# EAGLE design Rauchmelder 3.8.3 (EAGLE 9.6.2)
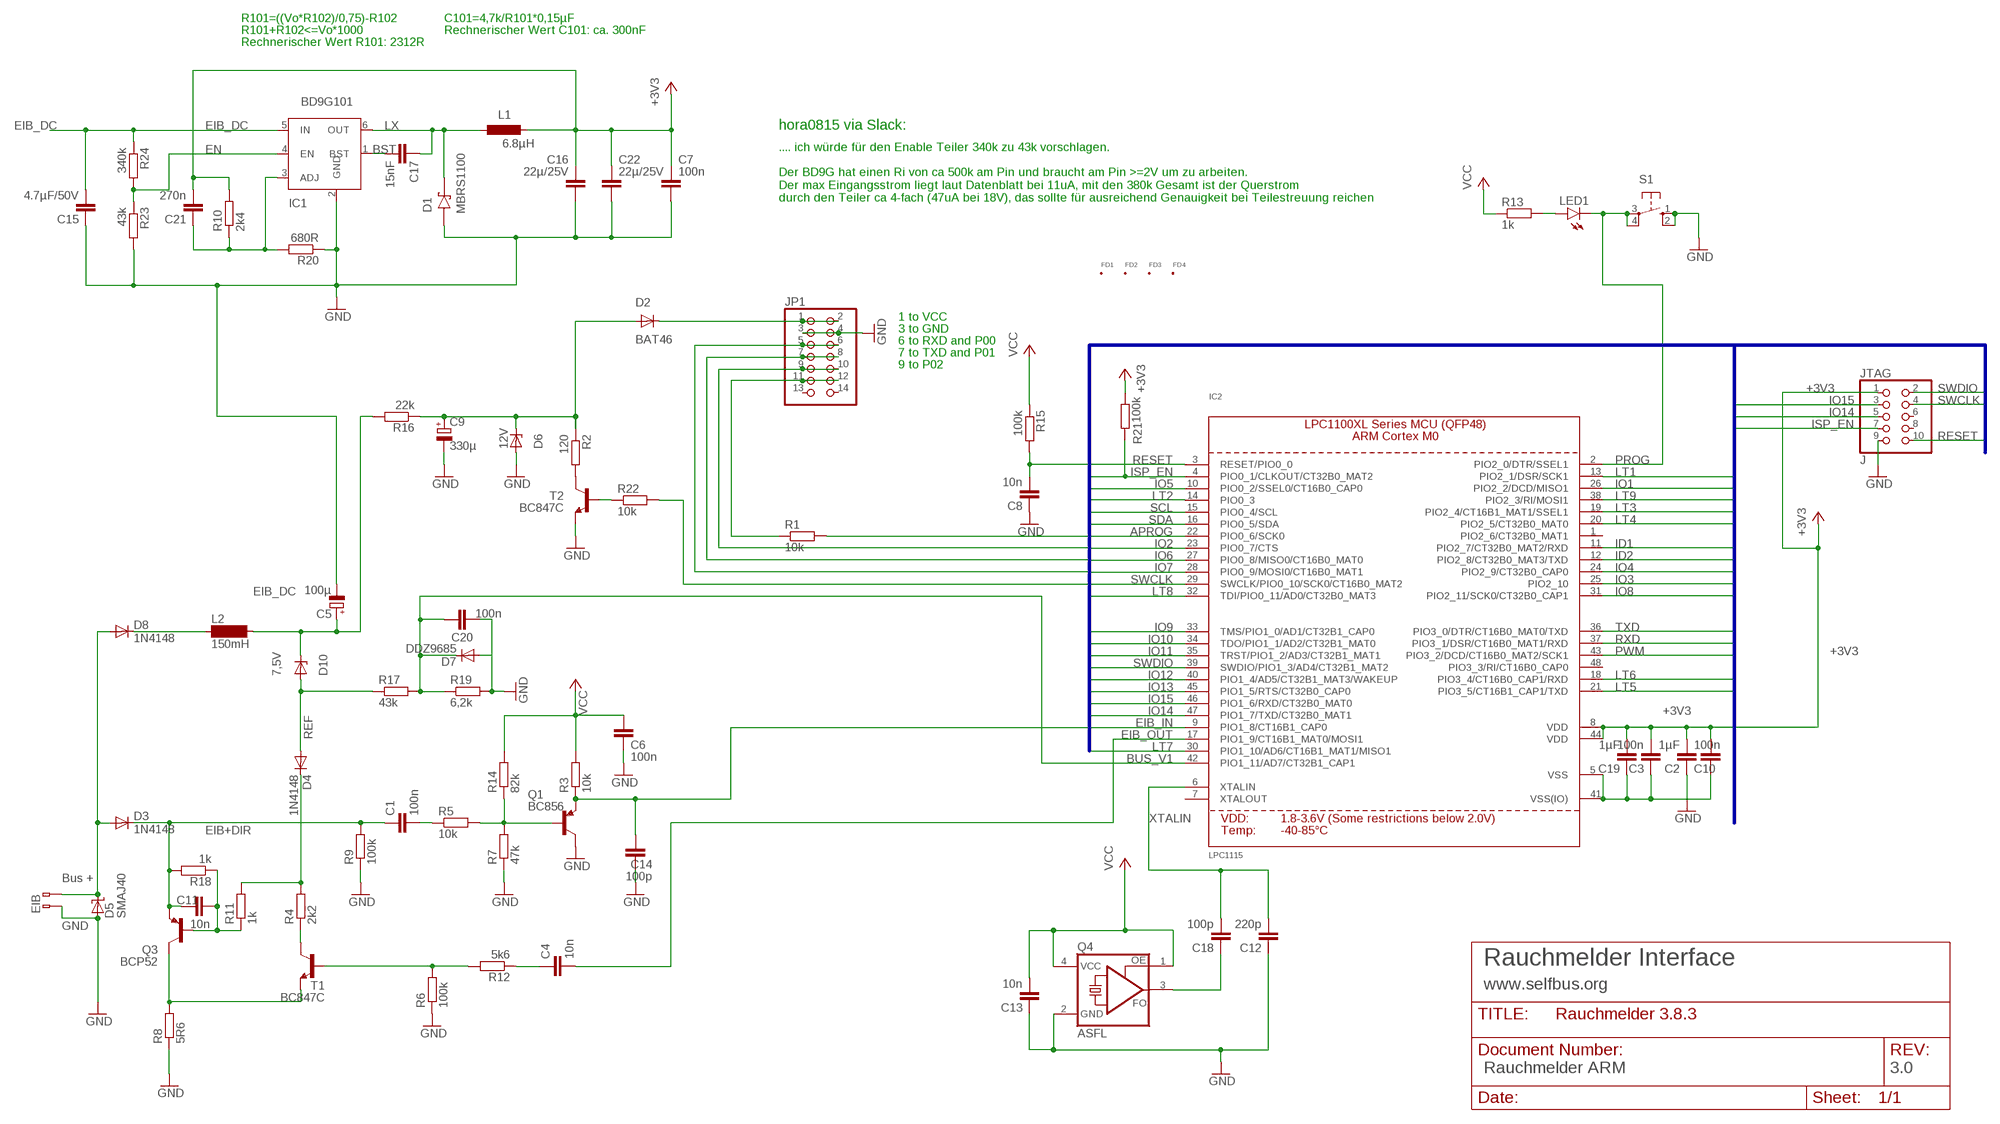
[diagram p0: schematic, sheet 1]

## Parts
C1  100n  C-EUC1206  [C1206]
C2  1µF  C-EUC1206  [C1206]
C3  100n  C-EUC1206  [C1206]
C4  10n  C-EUC1206  [C1206]
C5  100µ  CPOL-EUSANYO_SMD_C6  [SANYO-OSCON_SMD_C6]
C6  100n  C-EUC1206  [C1206]
C7  100n  C-EUC1206  [C1206]
C8  10n  C-EUC1206  [C1206]
C9  330µ  CPOL-EUE3.5-8  [E3,5-8]
C10  100n  C-EUC1206  [C1206]
C11  10n  C-EUC1206  [C1206]
C12  220p  C-EUC1206  [C1206]
C13  10n  C-EUC1206  [C1206]
C14  100p  C-EUC1206  [C1206]
C15  4.7µF/50V  C-EUC1206  [C1206]
C16  22µ/25V  C-EUC1206  [C1206]
C17  15nF  C-EUC1206  [C1206]
C18  100p  C-EUC1206  [C1206]
C19  1µF  C-EUC1206  [C1206]
C20  100n  C-EUC1206  [C1206]
C21  270n  C-EUC1206  [C1206]
C22  22µ/25V  C-EUC1206  [C1206]
D1  MBRS1100  SCHOTTKY-DIODE-MBR130LSFT1  [SOD123FL]
D2  BAT46  DIODE-MINIMELF  [MINIMELF]
D3  1N4148  DIODE-MINIMELF  [MINIMELF]
D4  1N4148  DIODE-MINIMELF  [MINIMELF]
D5  SMAJ40  SUPPRESSOR-SMBJ  [SMBJ]
D6  12V  ZPD  [MINIMELF]
D7  DDZ9685  DIODE-MINIMELF  [MINIMELF]
D8  1N4148  DIODE-MINIMELF  [MINIMELF]
D10  7,5V  ZPD  [MINIMELF]
FD1  FID_40MIL  [FID_040]
FD2  FID_40MIL  [FID_040]
FD3  FID_40MIL  [FID_040]
FD4  FID_40MIL  [FID_040]
IC1  BD9G101  BD9G101GBD9G101G-SOT23-6  [SOT23-6]
IC2  LPC1115  LPC1113/4/5_QFP48_XLSERIES  [LQFP48]
JP1  PINHD-2X7  [2X07]
JTAG  J  PINHD-2X05_2.00  [2X05M]
L1  6.8µH  L-EUL4532P  [L4532P]
L2  150mH  BS11  [BS11]
LED1  LEDCHIPLED_1206  [CHIPLED_1206]
Q1  BC856  BC856ALT1SMD  [SOT23-BEC]
Q3  BCP52  FZT753SMD  [SOT223]
Q4  ASFL  [ASF]
R1  10k  R-EU_R1206  [R1206]
R2  120  R-EU_R1206  [R1206]
R3  10k  R-EU_R1206  [R1206]
R4  2k2  R-EU_R1206  [R1206]
R5  10k  R-EU_R1206  [R1206]
R6  100k  R-EU_R1206  [R1206]
R7  47k  R-EU_R1206  [R1206]
R8  5R6  R-EU_R1210  [R1210]
R9  100k  R-EU_R1206  [R1206]
R10  2k4  R-EU_R1206  [R1206]
R11  1k  R-EU_R1206  [R1206]
R12  5k6  R-EU_R1206  [R1206]
R13  1k  R-EU_R1206  [R1206]
R14  82k  R-EU_R1206  [R1206]
R15  100k  R-EU_R1206  [R1206]
R16  22k  R-EU_R1206  [R1206]
R17  43k  R-EU_R1206  [R1206]
R18  1k  R-EU_R1206  [R1206]
R19  6,2k  R-EU_R1206  [R1206]
R20  680R  R-EU_R1206  [R1206]
R21  100k  R-EU_R1206  [R1206]
R22  10k  R-EU_R1206  [R1206]
R23  43k  R-EU_R1206  [R1206]
R24  340k  R-EU_R1206  [R1206]
S1  10-XX  [B3F-10XX]
T1  BC847C  [SOT23]
T2  BC847C  [SOT23]
U$1  EIB  [BUSKLEMME243-724]

## Nets
+3V3: C2.2 C3.2 C6.2 C7.1 C10.2 C13.2 C16.1 C19.2 C21.2 C22.1 IC2.8(VDD) IC2.44(VDD) JTAG.1 L1.2 Q4.1(OE) Q4.4(VCC) R3.2 R10.2 R13.1 R14.2 R15.1 R21.2 ; supply symbol labelled VCC
APROG: IC2.22(PIO0_6/SCK0)
BST: C17.2 IC1.1(BST)
BUS_V1: C20.2 D7.C IC2.42(PIO1_11/AD7/CT32B1_CAP1) R17.2 R19.1
EIB+: D3.A D5.C D8.A U$1.2(B-2)
EIB+DIR: C1.1 C11.1 D3.C Q3.3(E) R9.2 R18.2
EIB_DC: C5.+ C15.2 D10.C IC1.5(IN) L2.2 R16.2 R24.1
EIB_IN: C14.2 IC2.9(PIO1_8/CT16B1_CAP0) Q1.E R3.1
EIB_OUT: C4.2 IC2.17(PIO1_9/CT16B1_MAT0/MOSI1)
EN: IC1.4(EN) R23.1 R24.2
FB1: C21.1 IC1.3(ADJ) R10.1 R20.2
GND: C2.1 C3.1 C5.- C6.1 C7.2 C8.1 C9.- C10.1 C12.1 C13.1 C14.1 C15.1 C16.2 C19.1 C20.1 C22.2 D1.A D5.A D6.A D7.A IC1.2(GND) IC2.5(VSS) IC2.41(VSS(IO)) JP1.3 JP1.4 JTAG.9 Q1.C Q4.2(GND) R6.1 R7.1 R8.1 R9.1 R19.2 R20.1 R23.2 S1.1(S) S1.2(S1) T2.2(E) U$1.1(B-1)
ID1: IC2.11(PIO2_7/CT32B0_MAT2/RXD)
ID2: IC2.12(PIO2_8/CT32B0_MAT3/TXD)
IO1: IC2.26(PIO2_2/DCD/MISO1)
IO2: IC2.23(PIO0_7/CTS)
IO3: IC2.25(PIO2_10)
IO4: IC2.24(PIO2_9/CT32B0_CAP0)
IO5: IC2.10(PIO0_2/SSEL0/CT16B0_CAP0)
IO6: IC2.27(PIO0_8/MISO0/CT16B0_MAT0)
IO7: IC2.28(PIO0_9/MOSI0/CT16B0_MAT1)
IO8: IC2.31(PIO2_11/SCK0/CT32B0_CAP1)
IO9: IC2.33(TMS/PIO1_0/AD1/CT32B1_CAP0)
IO10: IC2.34(TDO/PIO1_1/AD2/CT32B1_MAT0)
IO11: IC2.35(TRST/PIO1_2/AD3/CT32B1_MAT1)
IO12: IC2.40(PIO1_4/AD5/CT32B1_MAT3/WAKEUP)
IO13: IC2.45(PIO1_5/RTS/CT32B0_CAP0)
IO14: IC2.47(PIO1_7/TXD/CT32B0_MAT1) JTAG.5
IO15: IC2.46(PIO1_6/RXD/CT32B0_MAT0) JTAG.3
ISP_EN: IC2.4(PIO0_1/CLKOUT/CT32B0_MAT2) JTAG.7 R21.1
LT1: IC2.13(PIO2_1/DSR/SCK1) R22.2
LT2: IC2.14(PIO0_3)
LT3: IC2.19(PIO2_4/CT16B1_MAT1/SSEL1)
LT4: IC2.20(PIO2_5/CT32B0_MAT0)
LT5: IC2.21(PIO3_5/CT16B1_CAP1/TXD) JP1.9 JP1.10
LT6: IC2.18(PIO3_4/CT16B0_CAP1/RXD)
LT7: IC2.30(PIO1_10/AD6/CT16B1_MAT1/MISO1)
LT8: IC2.32(TDI/PIO0_11/AD0/CT32B0_MAT3) R1.2
LT9: IC2.38(PIO2_3/RI/MOSI1)
LX: C17.1 D1.C IC1.6(OUT) L1.1
N$1: JP1.11 JP1.12 R1.1
N$2: Q1.B R5.2 R7.2 R14.1
N$3: R2.2 T2.3(C)
N$4: C11.2 Q3.1(B) R11.1 R18.1
N$5: R22.1 T2.1(B)
N$9: LED1.A R13.2
N$10: C9.+ D2.A D6.C R2.1 R16.1
N$13: D8.C L2.1
N$16: C1.2 R5.1
N$18: D2.C JP1.1 JP1.2
N$22: C4.1 R12.1
N$23: R4.1 T1.3(C)
N$25: D4.C R4.2 R11.2
N$26: Q3.2(C) Q3.4(C) R8.2 T1.2(E)
N$34: R6.2 R12.2 T1.1(B)
N$35: C18.1 Q4.3(FO)
PROG: IC2.2(PIO2_0/DTR/SSEL1) LED1.C S1.3(P) S1.4(P1)
PWM: IC2.43(PIO3_2/DCD/CT16B0_MAT2/SCK1)
REF: D4.A D10.A R17.1
RESET: C8.2 IC2.3(RESET/PIO0_0) JTAG.10 R15.2
RXD: IC2.37(PIO3_1/DSR/CT16B0_MAT1/RXD) JP1.5 JP1.6
SCL: IC2.15(PIO0_4/SCL)
SDA: IC2.16(PIO0_5/SDA)
SWCLK: IC2.29(SWCLK/PIO0_10/SCK0/CT16B0_MAT2) JTAG.4
SWDIO: IC2.39(SWDIO/PIO1_3/AD4/CT32B1_MAT2) JTAG.2
TXD: IC2.36(PIO3_0/DTR/CT16B0_MAT0/TXD) JP1.7 JP1.8
XTALIN: C12.2 C18.2 IC2.6(XTALIN)
Unconnected: IC2.1(PIO2_6/CT32B0_MAT1) IC2.7(XTALOUT) IC2.48(PIO3_3/RI/CT16B0_CAP0) JP1.13 JP1.14 JTAG.6 JTAG.8

## Buses
APROG,ID1,ID2,IO[1..15],ISP_EN,LT[1..9],PWM,RESET,RXD,SCL,SDA,SWCLK,SWDIO,TXD

## Notes on the sheet
- R101=((Vo*R102)/0,75)-R102 | C101=4,7k/R101*0,15µF
- R101+R102<=Vo*1000 | Rechnerischer Wert C101: ca. 300nF
- Rechnerischer Wert R101: 2312R
- hora0815 via Slack:
- .... ich würde für den Enable Teiler 340k zu 43k vorschlagen. 
  
  Der BD9G hat einen Ri von ca 500k am Pin und braucht am Pin >=2V um zu arbeiten. 
  Der max Eingangsstrom liegt laut Datenblatt bei 11uA, mit den 380k Gesamt ist der Querstrom 
  durch den Teiler ca 4-fach (47uA bei 18V), das sollte für ausreichend Genauigkeit bei Teilestreuung reichen
- 1 to VCC
- 3 to GND
- 6 to RXD and P00
- 7 to TXD and P01
- 9 to P02
- Bus +
- GND
- Rauchmelder Interface
- www.selfbus.org
- Rauchmelder ARM | 3.0

## Library data of the parts
C1-C4 C6 C8 C10-C14 C18-C20 = rcl:C-EU: CAPACITOR, European symbol
C5 C9 = rcl:CPOL-EU: POLARIZED CAPACITOR, European symbol
C7 = rcl:C-EU: CAPACITOR, European symbol; REICHELT: X7R-G0805 100N; SPICEPREFIX: C
C15 = rcl:C-EU: CAPACITOR, European symbol; REICHELT: X7R-G1206 4,7/50; SPICEPREFIX: C
C16 C22 = rcl:C-EU: CAPACITOR, European symbol; REICHELT: X5R-G0805 22/6; SPICEPREFIX: C
C17 = rcl:C-EU: CAPACITOR, European symbol; REICHELT: X7R-G0805 15N; SPICEPREFIX: C
C21 = rcl:C-EU: CAPACITOR, European symbol; REICHELT: Y5R-G0603 220N; SPICEPREFIX: C
D1 = bt_diode:SCHOTTKY-DIODE: Schottky Diode; ALTERNATIVE#1: RB060M-60; ALTERNATIVE#2: MBRS1100; REICHELT: MBRS 1100 SMD
D2-D4 D8 = diode:DIODE-: DIODE
D5 = diode:SUPPRESSOR-: Suppressor diode
D6 D10 = diode:ZPD: Z DIODE 500 mW
D7 = diode:DIODE-: DIODE; ALTERNATIVE: MMSZ4684T1G
FD1-FD4 = Fiducial:FID: Fiducial marks. Top and Bottom copper with stop mask
IC1 = Stefan_selfbus:BD9G101G
IC2 = microbuilder:LPC1113/4/5_QFP48_XLSERIES: LPC1113/4/5 ARM Cortex M0 MCU (50MHz) - XL Series (FBD48/3x3) LPC1115FBD48/303: Max Frequency: 50MHz Flash: 64kB SRAM: 8kB ADC: 10-bit
JP1 = pinhead:PINHD-2X7: PIN HEADER
JTAG = pinhead-2:PINHD-2X05: PIN HEADER
L1 = rcl_changed:L-EU: INDUCTOR, European symbol; REICHELT: L-1616FPS 6,8µ; SPICEPREFIX: L
L2 = inductor-neosid:BS: INDUCTOR nominal inductance, magnetically screened
LED1 = led:LED: LED OSRAM: - CHIPLED LG R971, LG N971, LY N971, LG Q971, LY Q971, LO R971, LY R971 LH N974, LH R974 LS Q976, LO Q976, LY Q976 LO Q996 - Hyper CHIPLED LW Q18S LB Q993, LB Q99A, LB R99A - SideLED LS A670, LO A670, LY A670, LG A670, LP A670 LB A673, LV A673, LT A673, LW A673 LH A674 LY A675 LS A676, LA A676, LO A676, LY A676, LW A676 LS A679, LY A679, LG A679 - Hyper Micro SIDELED® LS Y876, LA Y876, LO Y876, LY Y876 LT Y87S - SmartLED LW L88C, LW L88S LB L89C, LB L89S, LG L890 LS L89K, LO L89K, LY L89K LS L896, LA L896, LO L896, LY L896 - TOPLED LS T670, LO T670, LY T670, LG T670, LP T670 LSG T670, LSP T670, LSY T670, LOP T670, LYG T670 LG T671, LOG T671, LSG T671 LB T673, LV T673, LT T673, LW T673 LH T674 LS T676, LA T676, LO T676, LY T676, LB T676, LH T676, LSB T676, LW T676 LB T67C, LV T67C, LT T67C, LS T67K, LO T67K, LY T67K, LW E67C LS E67B, LA E67B, LO E67B, LY E67B, LB E67C, LV E67C, LT E67C LW T67C LS T679, LY T679, LG T679 LS T770, LO T770, LY T770, LG T770, LP T770 LB T773, LV T773, LT T773, LW T773 LH T774 LS E675, LA E675, LY E675, LS T675 LS T776, LA T776, LO T776, LY T776, LB T776 LHGB T686 LT T68C, LB T68C - Hyper Mini TOPLED® LB M676 - Mini TOPLED Santana® LG M470 LS M47K, LO M47K, LY M47K Source: http://www.osram.convergy.de LUXEON: - LUMILED® LXK2-PW12-R00, LXK2-PW12-S00, LXK2-PW14-U00, LXK2-PW14-V00 LXK2-PM12-R00, LXK2-PM12-S00, LXK2-PM14-U00 LXK2-PE12-Q00, LXK2-PE12-R00, LXK2-PE12-S00, LXK2-PE14-T00, LXK2-PE14-U00 LXK2-PB12-K00, LXK2-PB12-L00, LXK2-PB12-M00, LXK2-PB14-N00, LXK2-PB14-P00, LXK2-PB14-Q00 LXK2-PR12-L00, LXK2-PR12-M00, LXK2-PR14-Q00, LXK2-PR14-R00 LXK2-PD12-Q00, LXK2-PD12-R00, LXK2-PD12-S00 LXK2-PH12-R00, LXK2-PH12-S00 LXK2-PL12-P00, LXK2-PL12-Q00, LXK2-PL12-R00 Source: www.luxeon.com KINGBRIGHT: KA-3528ASYC Source: www.kingbright.com
Q1 = transistor-pnp:BC856*: PNP Transistror
Q3 = transistor-pnp:FZT753SMD: PNP Transistor
Q4 = crystal:ASF*: CRYSTAL CLOCK OSCILLATORS 5.0 Vdc or 3.3 Vdc - LOW PROFILE ULTRA MINIATURE CERAMIC SURFACE MOUNT Source: http://www.abracon.com/Oscillators/asf1-L-L1.pdf; MPN: ASFLM1-50.000MHZ-C-T; OC_FARNELL: 1838931; OC_NEWARK: 99M0411
R1-R7 R9 R11-R19 R21 R22 = rcl:R-EU_: RESISTOR, European symbol
R8 R23 R24 = rcl:R-EU_: RESISTOR, European symbol; SPICEPREFIX: R
R10 = rcl:R-EU_: RESISTOR, European symbol; REICHELT: SMD 1/4W 2,4K; SPICEPREFIX: R
R20 = rcl:R-EU_: RESISTOR, European symbol; REICHELT: SMD-0805 680; SPICEPREFIX: R
S1 = switch-omron:10-XX: OMRON SWITCH
T1 T2 = transistor:BC847C: NPN TRANSISTOR
U$1 = con-wago:EIB

## Board
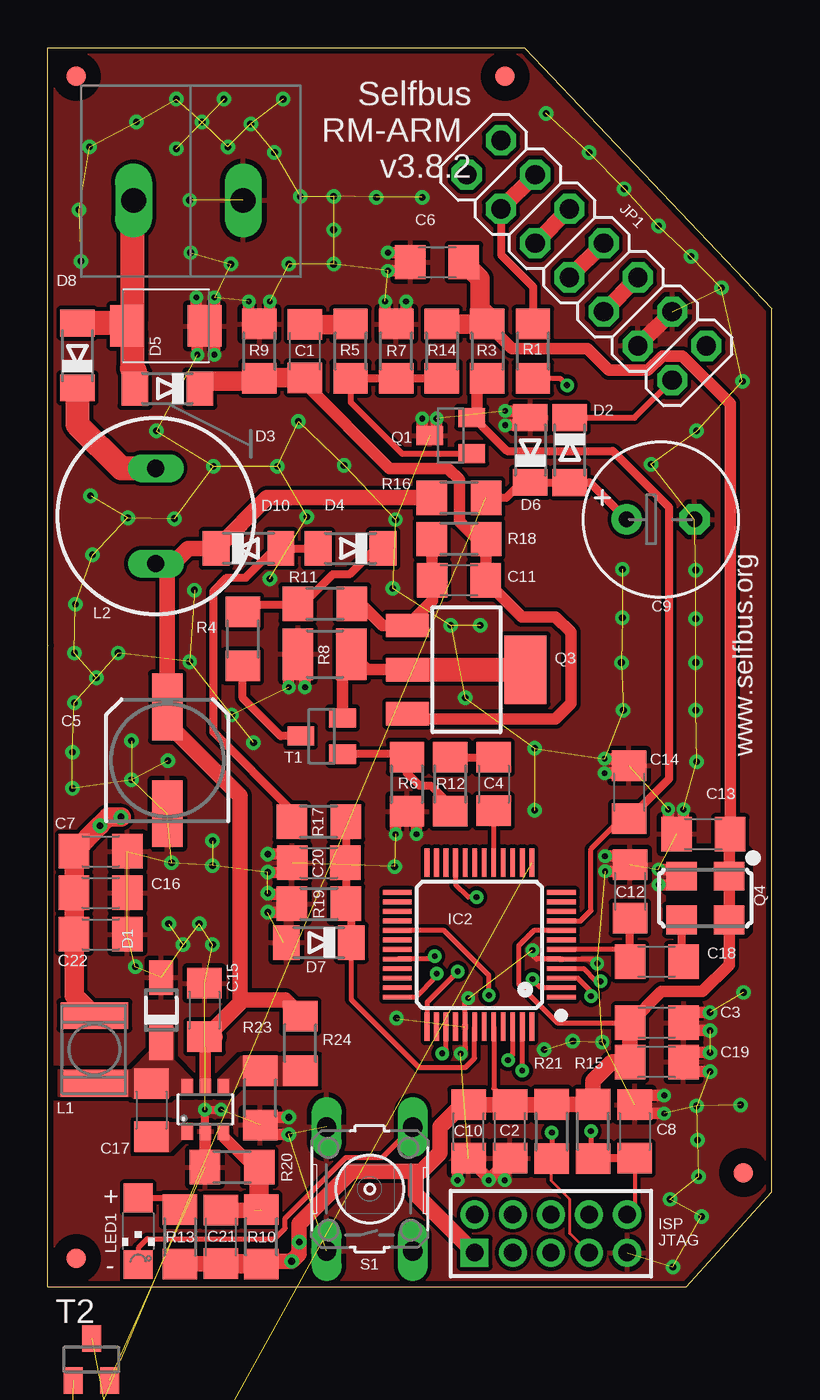
[diagram p1: board, top side]
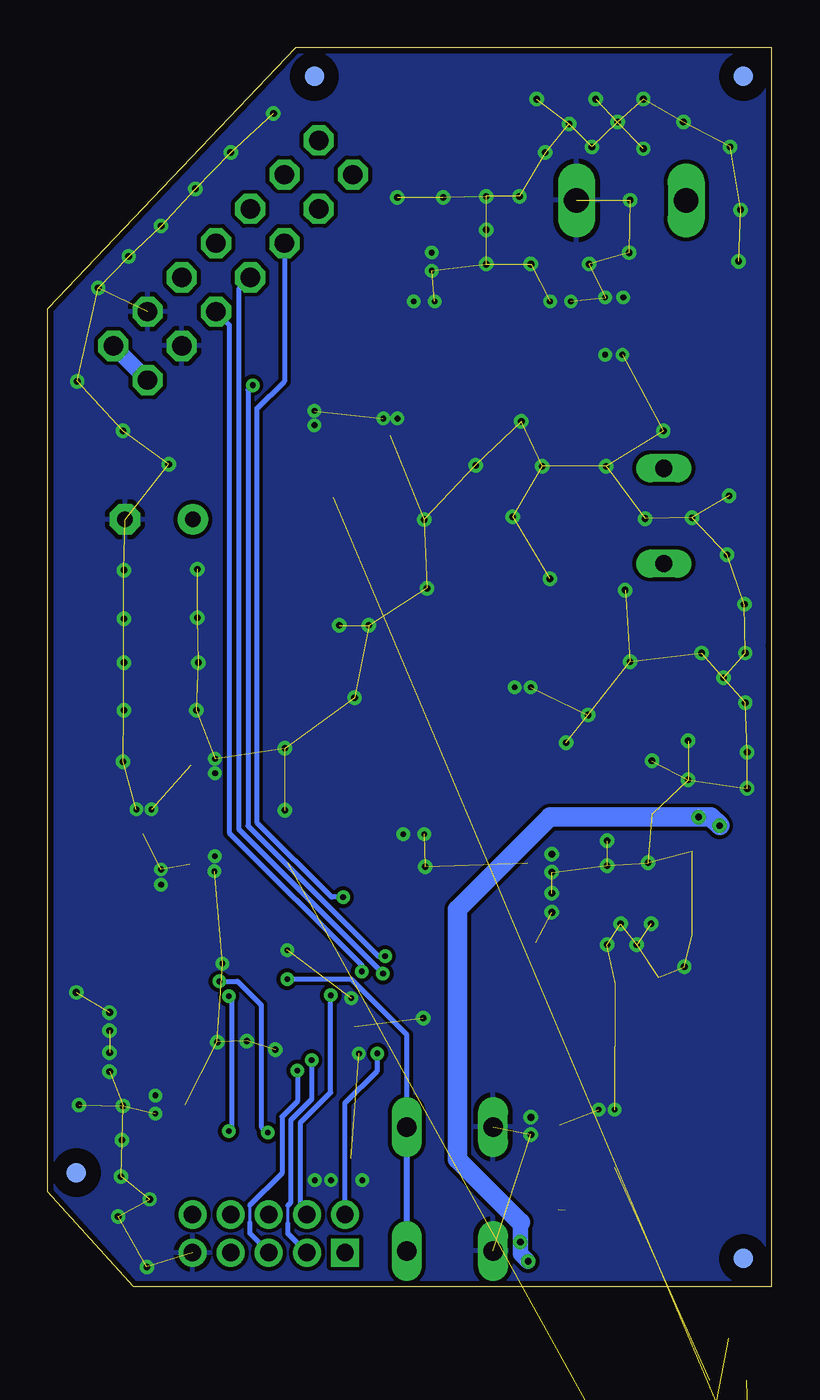
[diagram p2: board, bottom side, seen from below]

Size 38 x 65 mm. Coordinates in mm from the lower left corner, seen from the top.
Outline: 0,33.66 0.04,33.66
Outline: 0,0 0,65 25,65 38,51.3 38,5 33.5,0 0,0
Copper layers (1*16): Top 0.035mm / dielectric 1.5mm / Bottom 0.035mm
Design rules "default *": minimum track width 6mil, minimum drill 0.3mm, track to track 8mil, track to pad 7mil, pad to pad 8mil, via to via 8mil, smd to smd 0mil, copper to edge 12mil, drill to drill 8mil, minimum pad ring 11mil, minimum via ring 8mil, stop-mask expansion 4mil, vias tented up to drill 12mil, thermal gap 10mil
tRestrict: area 32.5,18.4 to 36.9,23.1

### Footprints (pad centres in the part's own frame; a part is rotated, then mirrored left to right if it is on the bottom)
C1206 = smd 1.6 x 1.8: 1 -1.4,0; 2 1.4,0
SANYO-OSCON_SMD_C6 = smd 3.5 x 1.6: + 2.8,0; - -2.8,0
E3,5-8 = drill 0.813 pad 1.6: + -1.778,0 | drill 0.813 pad 1.6 octagon: - 1.778,0
SOD123FL = smd 1.8 x 1.25: A 1.7,0; C -1.7,0
MINIMELF = smd 1.4 x 1.8: A 1.7,0; C -1.7,0
SMBJ = smd 1.78 x 2.16: A 2.04,0; C -2.03,0
FID_040 = smd 1.016 x 1.016 bottom: FIDB 0,0 | smd 1.016 x 1.016: FIDT 0,0
SOT23-6 = smd 0.6 x 0.9: 1 -0.95,-1.15; 2 0,-1.15; 3 0.95,-1.15; 4 0.95,1.15; 5 0,1.15; 6 -0.95,1.15
LQFP48 = smd 1.5 x 0.25: 1 -4.3,2.75; 2 -4.3,2.25; 3 -4.3,1.75; 4 -4.3,1.25; 5 -4.3,0.75; 6 -4.3,0.25; 7 -4.3,-0.25; 8 -4.3,-0.75; 9 -4.3,-1.25; 10 -4.3,-1.75; 11 -4.3,-2.25; 12 -4.3,-2.75; 25 4.3,-2.75; 26 4.3,-2.25; 27 4.3,-1.75; 28 4.3,-1.25; 29 4.3,-0.75; 30 4.3,-0.25; 31 4.3,0.25; 32 4.3,0.75; 33 4.3,1.25; 34 4.3,1.75; 35 4.3,2.25; 36 4.3,2.75 | smd 0.25 x 1.5: 13 -2.75,-4.3; 14 -2.25,-4.3; 15 -1.75,-4.3; 16 -1.25,-4.3; 17 -0.75,-4.3; 18 -0.25,-4.3; 19 0.25,-4.3; 20 0.75,-4.3; 21 1.25,-4.3; 22 1.75,-4.3; 23 2.25,-4.3; 24 2.75,-4.3; 37 2.75,4.3; 38 2.25,4.3; 39 1.75,4.3; 40 1.25,4.3; 41 0.75,4.3; 42 0.25,4.3; 43 -0.25,4.3; 44 -0.75,4.3; 45 -1.25,4.3; 46 -1.75,4.3; 47 -2.25,4.3; 48 -2.75,4.3
2X07 = drill 1.016 octagon: 1 -7.62,-1.27; 2 -7.62,1.27; 3 -5.08,-1.27; 4 -5.08,1.27; 5 -2.54,-1.27; 6 -2.54,1.27; 7 0,-1.27; 8 0,1.27; 9 2.54,-1.27; 10 2.54,1.27; 11 5.08,-1.27; 12 5.08,1.27; 13 7.62,-1.27; 14 7.62,1.27
2X05M = drill 0.914 square: 1 -4,-1 | drill 0.914: 2 -4,1; 3 -2,-1; 4 -2,1; 5 0,-1; 6 0,1; 7 2,-1; 8 2,1; 9 4,-1; 10 4,1
L4532P = smd 1.397 x 3.556: 1 -1.778,0; 2 1.778,0
BS11 = drill 0.9 long: 1 -2.5,0; 2 2.5,0
CHIPLED_1206 = smd 1.5 x 1.5: A 0,-1.75; C 0,1.75
SOT23-BEC = smd 1 x 1.4: B -0.95,-1.1; C 0,1.1; E 0.95,-1.1
SOT223 = smd 1.219 x 2.235: 1 -2.311,-3.099; 2 0,-3.099; 3 2.311,-3.099 | smd 3.6 x 2.2: 4 0,3.099
ASF = smd 1.6 x 1.5: 1 -1.25,-1.15; 2 1.25,-1.15; 3 1.25,1.15; 4 -1.25,1.15
R1206 = smd 1.6 x 1.803: 1 -1.422,0; 2 1.422,0
R1210 = smd 1.6 x 2.7: 1 -1.4,0; 2 1.4,0
B3F-10XX = drill 1.016 long: 1 -3.251,2.261; 2 3.251,2.261; 3 -3.251,-2.261; 4 3.251,-2.261
SOT23 = smd 1 x 1.4: 1 -0.95,-1.1; 2 0.95,-1.1; 3 0,1.1
BUSKLEMME243-724 = drill 1.3 long: 1 -2.875,0; 2 2.875,0

### Placement (x,y rotation side)
C1  13.5,49.08 90 top
C2  24.26,8.16 90 top
C3  31.96,13.86 180 top
C4  23.4,26.38 270 top
C5  6.27,27.62 90 top
C6  20.43,53.75 0 top
C7  2.78,22.85 0 top
C8  30.79,8.16 270 top
C9  32.16,40.26 0 top
C10  22.08,8.16 90 top
C11  21.58,37.06 180 top
C12  30.55,20.75 270 top
C13  34.4,23.75 0 top
C14  30.5,25.95 270 top
C15  8.23,14.53 270 top
C16  2.78,20.68 0 top
C17  5.45,9.28 270 top
C18  31.95,17.06 180 top
C19  31.95,11.8 180 top
C20  14.22,22.25 0 top
C21  9.08,2.63 270 top
C22  2.78,18.5 0 top
D1  5.96,14.53 90 top
D2  27.39,43.9 270 top
D3  6.28,47.12 180 top
D4  15.89,38.74 180 top
D5  6.21,50.4 0 top
D6  25.32,43.9 90 top
D7  14.22,18.06 180 top
D8  1.56,48.86 90 top
D10  10.53,38.74 0 top
FD1  1.5,63.5 0 top
FD2  36.5,6 0 top
FD3  24,63.5 0 top
FD4  1.5,1.5 0 top
IC1  8.27,9.32 0 top
IC2  22.65,17.95 180 top
JP1  28.27,53.85 135 top
JTAG  26.4,2.8 0 top
L1  2.45,12.46 90 top
L2  5.67,40.44 270 top
LED1  4.75,2.93 180 top
Q1  21.14,44.66 90 top
Q3  21.97,32.38 270 top
Q4  34.5,20.4 180 top
R1  25.46,49.08 270 top
R2  2.4,-10.6 0 top  (outside the outline)
R3  23.07,49.08 90 top
R4  10.23,34 90 top
R5  15.89,49.08 270 top
R6  18.85,26.38 90 top
R7  18.28,49.08 270 top
R8  14.53,33.19 0 top
R9  11.11,49.08 270 top
R10  11.2,2.63 270 top
R11  14.54,35.84 180 top
R12  21.13,26.38 270 top
R13  6.94,2.63 90 top
R14  20.68,49.08 90 top
R15  28.62,8.16 270 top
R16  21.58,41.4 180 top
R17  14.22,24.39 0 top
R18  21.58,39.23 0 top
R19  14.22,20.1 180 top
R20  9.68,6.28 0 top
R21  26.44,8.16 90 top
R22  2.4,-16.75 0 top  (outside the outline)
R23  11.15,9.92 270 top
R24  13.25,12.78 270 top
S1  16.89,5.14 90 top
T1  14.38,28.89 90 top
T2  2.3,-3.8 0 top
U$1  7.38,56.99 180 top

### Tracks (layer width: path | path; a pad name or v marks a point on that pad's centre or on a via)
+3V3  (via drill 0.35)
  Top 0.254: IC2.8 25.5,18.7 24.7,17.9 24.7,15.89 26.73,13.86 C3.2 | IC2.44 23.4,10.42 C2.2 | R13.1 6.96,1.23
  Top 0.406: C3.2
  Top 0.61: C3.2 32.2,15.5 34.35,15.5 35.75,16.9 Q4.4 Q4.1 35.75,23.7 C13.2 35.8,46.32 33.29,48.83 32.23,48.83 31.49,48.09 29.44,48.09 28.31,49.22 24.36,49.22 R3.2
  Top 0.813: 11.25,1.21 R10.2 11.35,1.35 v12.8,1.35 13.19,1.74 13.19,3.3 15.95,6.06 19.3,6.06 | 19.3,6.06 19.6,6.06 20.58,7.04 20.58,8.4 21.73,9.56 C10.2 C2.2 26.42,9.56 R21.2 R15.1 28.62,10.81 29.61,11.8 C19.2 C3.2 | 19.3,6.06 19.3,4.9 JTAG.1 | C21.2 6.96,1.23
  Top 1.016: R10.2 11.18,1.23 C21.2 | R14.2 R3.2 23.07,50.95 22.68,51.34 22.68,52.9 C6.2 | 1.4,20.69 C16.1 | v2.74,24.21 C7.1 C16.1 | v2.74,24.21 v2.75,24.2 | v3.85,24.65 3.18,24.65 v2.74,24.21 | 1.4,18.52 C22.1 | L1.2 1.4,15.29 1.4,18.52 | C16.1 1.38,18.53 1.4,18.52
  Top 1.27: L1.2 1.95,14.24
  Bottom 0.813: 13.2,3.4 v13.2,2.35 13.2,1.75 v12.8,1.35
  Bottom 1.016: v2.75,24.2 3.2,24.65 11.65,24.65 16.5,19.8 16.5,6.7 13.2,3.4
BST
  pour Top (no thermals): 4.6,8.65 6.3,8.65 6.35,8.6 7.6,8.6 7.6,7.75 7.05,7.75 6.4,7.1 4.6,7.1
BUS_V1
  Top 0.254: D7.C 15.92,15.08 19.48,11.52 21.92,11.52 22.4,12 IC2.42
  Top 0.406: R17.2 15.65,22.27 C20.2 15.65,22.23 R19.1 15.92,19.82 D7.C
EIB+
  Top 1.27: U$1.2 4.43,56.91 4.43,50.65 D5.C | D5.C 4.02,50.56 D8.A | D3.A 4.58,48.02 4.43,48.17 4.43,50.15 D5.C
EIB+DIR
  Top 0.61: C1.1 13.5,47.38 17.95,42.94 21,42.94 21.6,42.34 21.6,40.15 22.52,39.23 R18.2 23,37.08 C11.1 24.89,35.15 26.65,35.15 27.45,34.35 27.45,30.6 26.65,29.8 19.14,29.8 Q3.3
  Top 1.016: D3.C 8.37,47.51 10.96,47.51 R9.2 11.13,47.68 C1.1
EIB_DC
  Top 0.61: IC1.5 8.27,13.09 C15.2
  Top 0.813: R16.2 11.52,41.4 8.86,38.74 D10.C 7.37,38.74 6.57,37.94 L2.2 5.92,37.94 6.27,37.59 C5.+ 6.27,29.57 10.1,25.74 10.1,14.99 | 8.78,13.12 C15.2 8.3,13.2 8.4,13.2 10.1,14.89 10.1,14.99 | 10.1,14.99 10.15,15.04 12.46,15.04 13.25,14.26 R24.1
EIB_IN
  Top 0.254: IC2.9 27.95,19.2 28.5,19.75 28.5,22.97 30.08,24.55 C14.2
  Top 0.406: Q1.E 22.34,45.61 24.1,43.85 29.65,43.85 32.6,40.9 32.6,26.65 C14.2
  Top 0.61: R3.1 22.52,47.11 22.52,45.88 Q1.E
EIB_OUT
  Top 0.254: IC2.17 C4.2
EN
  pour Top (no thermals): 8.95,10.05 8.95,10.9 10.15,12.1 14.15,12.1 14.15,10.55 10,10.55 9.5,10.05
FB1  (1 unrouted)
  Top 0.61: IC1.3 9.22,7.88 10.82,6.28 R20.2
  Top 0.813: 10.87,4.03 C21.1 | 10.77,4.48 R10.1 11.1,3.95
  Top 1.016: R20.2 11.1,3.95
GND  (via drill 0.3, 0.35)  (128 unrouted)
  Top 0.254: v25.43,17.67 25.43,17.41 25.64,17.2 IC2.5 28.6,17.2 v28.83,16.97 | v21.67,12.24 21.9,12.48 IC2.41 21.9,14.98 v22.07,15.14
  Top 0.406: IC1.2 8.27,9.28 v8.25,9.3 v9.1,9.3 | C6.1 18.53,54.25 | C20.1 12.4,22.25
  Top 0.61: IC1.2 8.27,6.29 R20.1 | 18.53,54.25 v17.85,54.25 | v11.55,22.7 12.37,22.7 C20.1 12.33,21.75 v11.55,21.75 | v11.55,20.65 11.6,20.6 12.3,20.6 R19.2 12.35,19.65 v11.55,19.65 | D7.A 12.37,18.06 | v34.75,14.4 33.9,14.4 C3.1 33.78,13.45 v34.75,13.45 | v34.75,12.3 33.85,12.3 C19.1 33.85,11.3 v34.75,11.3 | v32.35,10.05 31.29,10.05 C8.1 31.25,9.1 v32.35,9.1 | v21.5,5.6 21.5,6.17 C10.1 23.08,5.76 23.13,5.76 | 23.13,5.76 v23.13,5.6 | 23.13,5.76 23.26,5.76 C2.1 23.98,6.48 v23.98,5.6 | C6.1 18.59,53.3 v17.85,53.3 | v29.22,26.95 30.1,26.95 C14.1 30.15,27.7 v29.22,27.7 | v29.23,22.6 30.1,22.6 C12.1 30.2,21.8 v29.25,21.8 | v32.55,25.05 32.55,24.2 C13.1 33.35,24.1 v33.35,25.05 | v32.05,21.9 32.85,21.9 33.2,21.55 Q4.2 32.8,21.1 v32.05,21.1 | D5.A 7.8,50.85 v7.8,51.9 | D5.A | D5.A 8.25,50.05 7.85,49.65 v7.85,48.9 | v8.75,51.9 8.75,50.91 D5.A | D5.A 8.75,49.9 v8.75,48.9 | v12.65,31.45 12.65,32.73 R8.1 13.5,32.8 v13.5,31.45 | v18.25,23.75 18.25,24.35 R6.1 19.35,24.45 v19.35,23.75 | v18.8,51.7 18.8,51.02 R7.1 17.78,50.51 17.7,50.59 v17.7,51.7 | v11.65,51.7 11.65,51.05 R9.1 11.01,50.51 10.55,50.96 v10.55,51.7 | v24,45.95 24.97,45.95 D6.A 25.22,45.6 24.82,45.2 v24,45.2 | v19.65,45.55 19.65,45.05 Q1.C 20.4,45.01 v20.4,45.55 | v12.65,8.9 11.56,8.9 R23.2 11.65,8 v12.65,8
  Top 0.813: JP1.4 JP1.3
  other vias: 21.15,34.7 22.7,34.7 18.1,36.65 13.6,40.4 18.25,40.25 11.65,37.15 2.25,41.5 2.35,38.4 15.55,43.1 8.7,43.05 13.15,45.4 5.7,44.9 4.2,40.35 6.65,40.3 34,37.6 34,35.05 34,32.75 34,30.25 34.05,27.55 25.55,28.25 25.55,25 30.2,30.25 30.1,32.75 30.15,35.1 30.15,37.65 15,57.2 17.25,57.15 19.65,57.15 15,55.45 6.75,62.3 4.65,61.1 2.2,59.8 6.75,59.7 8.1,61.1 9.25,62.3 11.9,59.5 9.45,59.8 10.65,61 12.35,62.3 34.05,9.5 36.35,9.55 34.1,7.7 34.15,5.8 34.3,3.7 32.65,4.6 32.8,1.05 1.3,28.05 1.4,30.65 1.4,33.25 1.45,35.8 3.7,33.25 2.55,31.95 4.4,28.65 4.4,26.6 6.35,19.05 1.3,26.15 1.75,53.8 1.65,56.5 7.45,57 7.5,54.25 12.65,53.65 9.6,53.65 13.25,57.2 26.15,61.55 28.4,59.5 30.25,57.6 32.05,55.65 33.75,54.05 35.35,52.4 18.2,22.05 18.3,14.1 36.5,15.45 10.8,28.55 21.9,30.9 31.65,43.15 34.05,44.9 36.45,47.5 12.05,43.05 6.3,27.6 9.65,30 7.7,36.55 7.45,32.8 8.65,23.4 8.65,22.1 7.95,19.05 8.65,17.95 4.6,16.8 15,53.65 7.1,17.95 6.5,22.25 27.55,12.9 29.1,12.85 26.05,12.45
  pour Bottom (rank 2): 33.5,0 0,0 0,65 25,65 38,51.3 38,5
  pour Top (rank 2): 33.5,0 0,0 0,65 25,65 38,51.3 38,5
IO14  (via drill 0.3)
  Top 0.254: v24.9,11.35 IC2.47
  Bottom 0.152: 27.39,3.39 27.39,4.26 27.4,4.27
  Bottom 0.254: v24.9,11.35 24.9,9.74 25.71,8.93 25.71,5.96 27.4,4.27 | 27.39,3.39 27.39,2.79 JTAG.5
IO15  (via drill 0.3)
  Top 0.254: v24.15,11.9 24.4,12.15 IC2.46
  Bottom 0.152: 25.4,3.33 25.4,4.27
  Bottom 0.254: v24.15,11.9 24.15,9.85 25.25,8.74 25.25,4.42 25.4,4.27 | JTAG.3 25.4,2.8 25.4,3.33
ISP_EN  (via drill 0.3)
  Top 0.152: JTAG.7 27.39,2.81 27.39,4.61 26.44,5.56 R21.1
  Top 0.254: IC2.4 28.13,16.7 28.8,16.03 v29,16.03 | v26.45,8.1 R21.1
  Bottom 0.254: v29,16.03 28.05,16.03 26.8,14.79 26.8,8.4 26.5,8.1 v26.45,8.1
LT1  (1 unrouted)
LT5  (via drill 0.3)
  Top 0.254: v22.5,20.45 22.05,20.45 21.4,21.1 IC2.21
  Top 0.813: JP1.9 JP1.10
  Bottom 0.254: JP1.10 25.58,47.5 27.03,46.05 27.03,24.38 23.1,20.45 v22.5,20.45
LT8  (via drill 0.3)
  Top 0.254: R1.2 26.88,47.66 v27.24,47.3 | v20.3,17.35 20.15,17.2 IC2.32
  Bottom 0.254: v27.24,47.3 27.49,47.05 27.49,24.19 20.65,17.35 v20.3,17.35
LX
  pour Top (no thermals): 6.6,11.9 6.6,13.65 6.55,13.7 5.4,13.7 5.35,13.65 5.35,12.35 4.4,11.4 0.55,11.4 0.55,10 4.4,10 4.5,9.9 6.3,9.9 6.45,10.05 7.6,10.05 7.6,10.9
N$1
  Top 0.406: R1.1 25.46,52.46 23.78,54.14 JP1.12
  Top 0.813: JP1.11 JP1.12
N$2
  Top 0.305: R5.2 15.89,46.41 18.6,43.7 Q1.B
  Top 0.406: R5.2 R7.2 R14.1
N$3  (1 unrouted)
N$4
  Top 0.61: R18.1 20.16,37.08 C11.2 20.18,35.99 Q3.1 17.57,34.69 16.42,35.84 R11.1
N$5  (1 unrouted)
N$9
  Top 0.305: LED1.A 6.31,4.68 R13.2
N$10  (1 unrouted)
  Top 0.406: R16.1 24.06,41.4 24.87,42.2 D6.C D2.A 28.45,42.2 C9.+
N$13
  Top 1.27: D8.C 1.56,45.24 3.86,42.94 L2.1
N$16
  Top 0.406: 15.87,50.48 R5.1
  Top 1.016: C1.2 15.87,50.48
N$18
  Top 0.305: D2.C 30.79,45.59 JP1.2
  Bottom 0.813: JP1.2 JP1.1
N$22
  Top 0.406: R12.1 21.15,27.77 C4.1
N$23
  Top 0.406: T1.3 12.23,28.89 10.23,30.89 R4.1
N$25
  Top 0.406: R4.2 10.58,35.77 13.06,35.77 R11.2 13.43,35.84 14.96,37.37 15.83,37.37 17.19,38.74 D4.C
N$26
  Top 0.406: T1.2 15.76,30.12 | R8.2 16.51,32.64 | 18.62,32.64 Q3.2
  Top 0.61: T1.2 15.48,32.73 R8.2 16.74,32.38 Q3.2
  Top 1.27: Q3.2 Q3.4
N$34
  Top 0.406: T1.1 18.7,27.95 R6.2 18.85,26.95 19.5,26.3 20.1,26.3 21.13,25.27 R12.2
N$35
  Top 0.406: Q4.3 33.25,17.16 C18.1
PROG  (via drill 0.3)
  Top 0.254: IC2.2 25.88,15.7 v25.43,16.15 | S1.4 17.56,6.8 15.65,6.8 12.46,3.61 12.46,3.08 11.91,2.53 5.23,2.53 4.75,2.05 LED1.C
  Bottom 0.254: v25.43,16.15 22.08,16.15 19.15,13.22 S1.4
  Bottom 0.305: S1.3 S1.4
REF
  Top 0.406: D4.A D10.A 11.93,38.74 10.4,37.2 9.4,37.2 8.7,36.5 8.7,29.1 12.8,25 R17.1
RESET  (via drill 0.3)
  Top 0.2: JTAG.10 30.6,3.8 30.79,3.99 C8.2
  Top 0.254: IC2.3 27.8,16.2 28.5,15.5 v28.5,15.25 | v28.5,8.17 28.5,6.85 R15.2
  Top 0.406: C8.2 30.77,6.74 R15.2
  Bottom 0.254: v28.5,15.25 28.35,15.1 28.35,8.32 v28.5,8.17
RXD  (via drill 0.3)
  Top 0.254: v21.52,16.55 19.9,14.93 IC2.37
  Top 0.813: JP1.5 JP1.6
  Bottom 0.254: JP1.6 28.47,50.46 28.47,23.82 21.52,16.87 v21.52,16.55
SWCLK  (via drill 0.3)
  Top 0.254: v23.15,15.3 23.15,16.35 20.8,18.7 IC2.29
  Bottom 0.254: JTAG.4 24.75,4.15 24.75,8.6 23.15,10.2 v23.15,15.3
SWDIO  (via drill 0.3)
  Top 0.254: v20.7,12.25 20.9,12.45 IC2.39
  Bottom 0.254: JTAG.2 22.4,9.65 20.7,11.35 v20.7,12.25
TXD  (via drill 0.3)
  Top 0.254: v20.41,16.44 20.41,16.3 19.31,15.2 IC2.36
  Top 0.813: JP1.7 JP1.8
  Bottom 0.254: JP1.8 27.97,52.35 27.97,24.02 20.41,16.46 v20.41,16.44
XTALIN
  Top 0.254: IC2.6 29.91,17.7 C18.2
  Top 0.406: C18.2 C12.2

### Text on the board
tPlace: Selfbus / RM-ARM / v3.8.2 | + | -
tNames: www.selfbus.org | ISP
bDocu: C21 = 270n